# Altium project Tiny_Arduino.PrjPcb
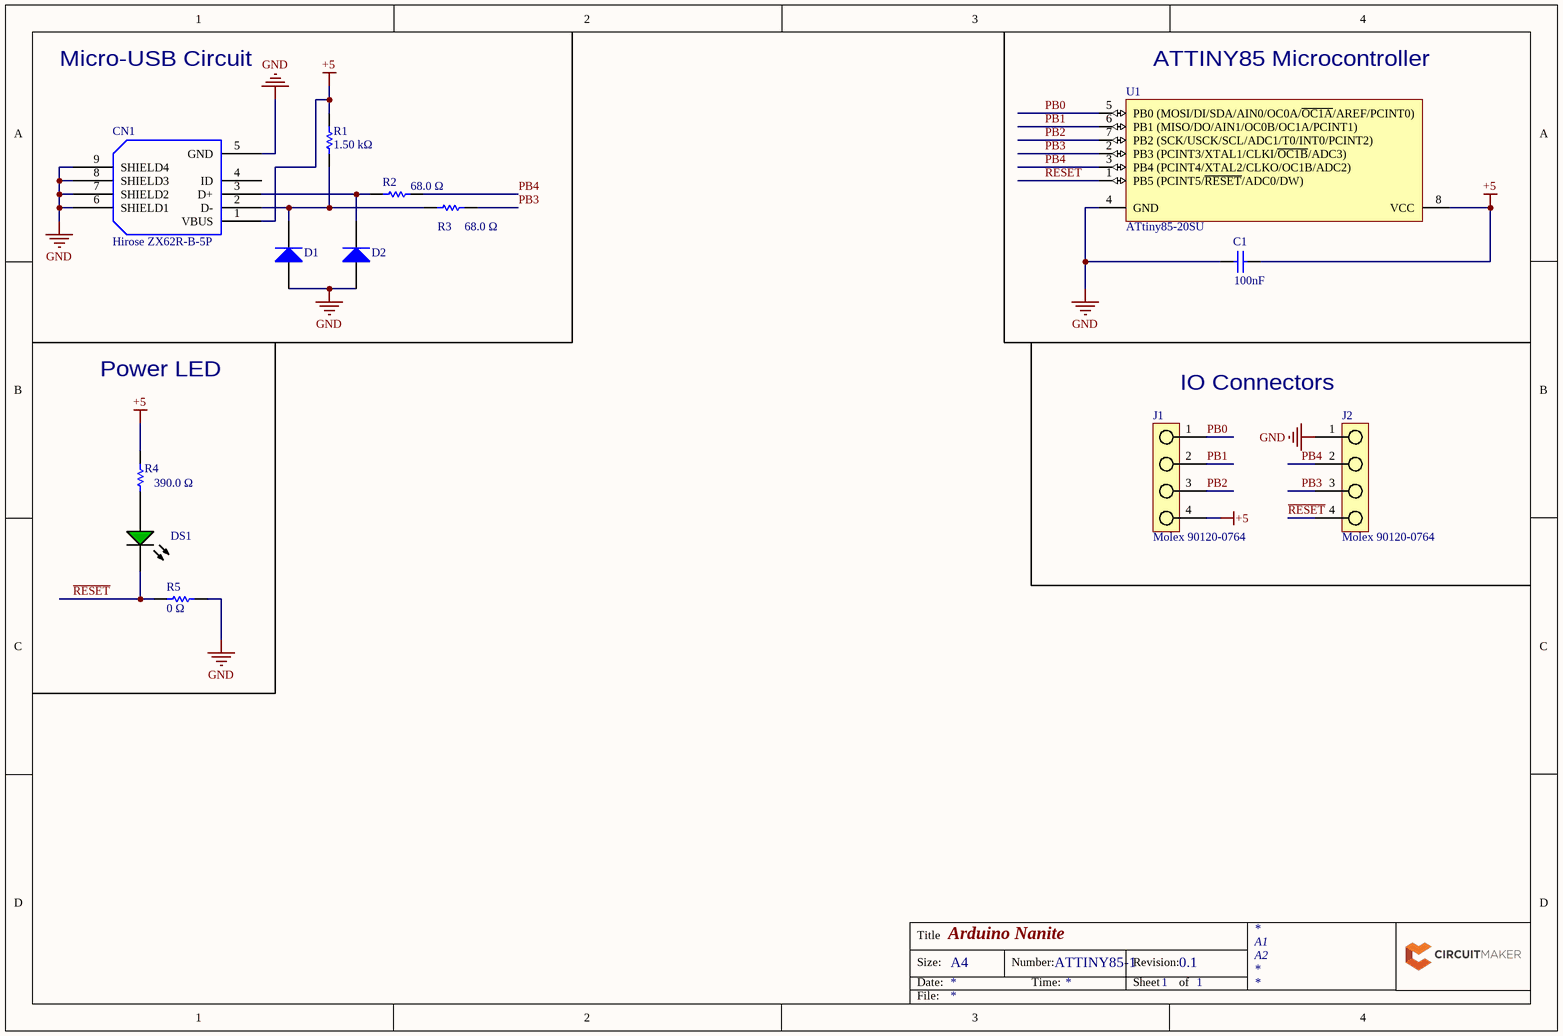
[diagram p0: Tiny_Arduino_Sch.SchDoc]
1 sheet, 13 parts. Net scope: global (net labels, ports and power ports of the same name join across sheets).

## Sheet Tiny_Arduino_Sch.SchDoc: Arduino Nanite
size A4; CompanyName: None; DrawnBy: Justin Beltran; Address1: A1; Address2: A2; DocumentNumber: ATTINY85-1; Revision: 0.1; SheetNumber: 1; SheetTotal: 1; ProjectName: Arduino_Nanite

### Parts
C1  Capacitance: 100nF  [CAPC1608X90X35LL15T15]  (hidden comment: AVX Interconnect / Elco 06033C104JAT2A)
CN1  Hirose ZX62R-B-5P  [PCB-kuo5gykd7jvbo0o0jro3-1]
D1  Panasonic DB2J40700L  [PCB-2omd1n8vppfni68elkoq-1]  (value not drawn)
D2  Panasonic DB2J40700L  [PCB-2omd1n8vppfni68elkoq-1]  (value not drawn)
DS1  Vishay Semiconductor TLMG1100-GS08  [VSH-TLMX1100]  (value not drawn)
J1  Molex 90120-0764  [PCB-mruwntkvy73mrw75dg9m-1]
J2  Molex 90120-0764  [PCB-mruwntkvy73mrw75dg9m-1]
R1  Resistance: 1.50 kΩ  [0603R]  (hidden comment: Panasonic / Panasonic ECG ERJ-3EKF1501V)
R2  Resistance: 68.0 Ω  [RESC1608X55X30LL15T15]  (hidden comment: Panasonic ERJ-3GEYJ680V)
R3  Resistance: 68.0 Ω  [RESC1608X55X30LL15T15]  (hidden comment: Panasonic ERJ-3GEYJ680V)
R4  Resistance: 390.0 Ω  [RESC1608X55X30LL15T15]  (hidden comment: Panasonic ERJ-3GEYJ391V)
R5  0 Ω  [RESC1608X05N]
U1  ATtiny85-20SU  [8S2_L]

### Nets
+5: C1.2 CN1.1(VBUS) J1.4 R1.2 R4.2 U1.8(VCC)
GND: C1.1 CN1.5(GND) CN1.6(SHIELD1) CN1.7(SHIELD2) CN1.8(SHIELD3) CN1.9(SHIELD4) D1.1(A) D2.1(A) J2.1 R5.2 U1.4(GND)
~{RESET}: DS1.2(K) J2.4 R5.1 U1.1(PB5_(PCINT5/~{RESET}/ADC0/DW))
PB0: J1.1 U1.5(PB0_(MOSI/DI/SDA/AIN0/OC0A/~{OC1A}/AREF/PCINT0))
PB1: J1.2 U1.6(PB1_(MISO/DO/AIN1/OC0B/OC1A/PCINT1))
PB2: J1.3 U1.7(PB2_(SCK/USCK/SCL/ADC1/T0/INT0/PCINT2))
PB3: J2.3 R3.2 U1.2(PB3_(PCINT3/XTAL1/CLKI/~{OC1B}/ADC3))
PB4: J2.2 R2.2 U1.3(PB4_(PCINT4/XTAL2/CLKO/OC1B/ADC2))
NetCN1_2: CN1.2(D-) D1.2(K) R1.1 R3.1
NetCN1_3: CN1.3(D+) D2.2(K) R2.1
NetDS1_1: DS1.1(A) R4.1

Not connected (* = marked no-connect by the designer): CN1 4(ID)

### Notes on the sheet
- Micro-USB Circuit
- (near U1) ATTINY85 Microcontroller
- Power LED
- IO Connectors
- Title
- Size:
- Date:
- A4
- Number:
- Time:
- Revision:
- Sheet
- of
- File:

### Library data of the parts
C1 = CMP-19299432-4: CAP CER 0.1UF 25V 5% X7R 0603; Voltage Rating (DC): 25.0 V; Dielectric Material: Ceramic Multilayer; Lead-Free Status: Lead Free; Mounting Style: Surface Mount; Case/Package: 0603; Dielectric Characteristic: X7R; Manufacturer Part Number: 06033C104JAT2A; Size-Height: 0.00086 m; RoHS: Compliant; Size-Length: 0.0016 m; Octopart Url: https://octopart.com/06033c104jat2a-avx+interconnect+%2F+elco-195750; Size-Width: 0.00081 m; REACH SVHC Compliance: No SVHC; Number of Pins: 2; Capacitance Tolerance: ±5%; OctopartID: 9a4d5345438d458a
CN1 = ZX62R-B-5P: copper, gold, series, pos, Connectors and Adapters, Wire to Board, pitch, solder, receptacle, conn, connector, rows, ...; Lead-Free Status: Lead Free; Gender: Female; Number of Contacts: 5; Mounting Style: Surface Mount; Orientation: Right Angle; Packaging: Cut Tape (CT); Octopart URL: http://octopart.com/zx62r-b-5p-hirose-44378731; Manufacturer Part Number: ZX62R-B-5P; RoHS: Compliant; OctopartID: d224198bdd290de3; REACH SVHC Compliance: No SVHC; Contact Plating: Gold; Contact Material: Copper
D1 D2 = CMP-6124aa8bc752bee3-1: Sc, Schottky Barrier Diode / Single, For Rectification, Vr: 40v, If: 500ma; Manufacturer Part Number: DB2J40700L; RoHS: Compliant; Octopart URL: http://octopart.com/db2j40700l-panasonic-44401424; OctopartID: 6124aa8bc752bee3; Number of Pins: 2; REACH SVHC Compliance: No SVHC; Lifecycle Status: Not Listed by Manufacturer
DS1 = CMP-1544807-2: LED 0603 ULTRA BRIGHT GRN 35MCD; Color: Green; Forward Voltage: 2.1 V; Lead-Free Status: Lead Free; Luminous Intensity: 0.035 cd; Peak Wavelength: 5.72e-07 m; Power Dissipation: 0.09 W; Viewing Angle: 160 °; Voltage Rating (DC): 3.0 V; Mounting Style: Surface Mount; Number of Pins: 2; Octopart Url: https://octopart.com/tlmg1100-gs08-vishay-42333640; OctopartID: 4d7f86f09dd192b8; REACH SVHC Compliance: No SVHC; RoHS: Compliant; Wavelength: 5.72e-07 m; Manufacturer Part Number: TLMG1100-GS08
J1 J2 = 90120-0764: 2.54mm (.100") Pitch C-Grid III Header, Single Row, Vertical, 3 Circuits, 0.38µm (15µ") Gold (Au) Selective Plating; Number of Contacts: 4; Current Rating: 3.00 A; Contact Resistance: 20.0 mΩ; Number of Circuits: 3; Gender: Male; Insulation Resistance: 5.00 GΩ; Lead-Free Status: Lead Free; Voltage Rating (DC): 350 V; Glow Wire Compliant: Non-Compliant; Contact Material: Copper; Mounting Style: Through Hole, Vertical; Octopart URL: http://octopart.com/90120-0764-molex-655426; RoHS: Compliant; Material: Polyester; Packaging: Bag; Manufacturer Part Number: 90120-0764; Voltage Rating (AC): 350 V; Size-Width: 2.54 mm; Pin Pitch: 2.54 mm; Housing Material: Plastic; Size-Height: 2.50 mm; Number of Positions: 4; Number of Rows: 1; Housing Color: Black; OctopartID: f5c93cc9d0ed2a0e; Lifecycle Status: Not Listed by Manufacturer; Orientation: Vertical; Halogen Free Status: Not Halogen Free; Size-Length: 10.2 mm; Contact Plating: Gold
R1 = CMP-3653708-3: Res Thick Film 0603 1.5K Ohm 1% 0.1W(1/10W) ??100ppm/??C Molded SMD Automotive T/R; Voltage Rating (DC): 75.0 V; Lead-Free Status: Lead Free; Power Rating: 100 mW; Lifecycle Status: Not Listed by Manufacturer; Size-Height: 450 µm; Octopart Url: http://octopart.com/erj-3ekf1501v-panasonic-55403651; Packaging: Tape & Reel (TR), Cut Tape (CT); OctopartID: a08c6acbe1697f4b; RoHS: Compliant; REACH SVHC Compliance: No SVHC; Manufacturer Part Number: ERJ-3EKF1501V; Resistance Tolerance: ±1%; Case/Package: 0603; Size-Length: 1.60 mm; Size-Width: 800 µm; Mounting Style: Surface Mount; Seller Landing  Url: https://octopart-clicks.com/click/track?country=US&ak=8157f166&sig=05cf646&sid=1106&ppid=55403651&vpid=188035540&ct=offers; Number of Pins: 2
R2 R3 = CMP-3708367-2: RES SMD 68 OHM 5% 1/10W 0603; Lead-Free Status: Lead Free; Power Rating: 0.1 W; Voltage Rating (DC): 75.0 V; Manufacturer Part Number: ERJ-3GEYJ680V; Case/Package: 0603; Lifecycle Status: Not Listed by Manufacturer; Mounting Style: Surface Mount; Octopart Url: https://octopart.com/erj-3geyj680v-panasonic-55422139; OctopartID: a4166e512dcb7bd1; Packaging: Cut Tape (CT); REACH SVHC Compliance: No SVHC; Resistance Tolerance: ±5%; RoHS: Compliant; Size-Height: 0.00045 m; Size-Length: 0.0016 m; Size-Width: 0.0008 m
R4 = CMP-3653665-2: Thick Film Resistors - SMD 0603 390ohms 5% Tol; Lead-Free Status: Lead Free; Power Rating: 0.1 W; Voltage Rating (DC): 75.0 V; Manufacturer Part Number: ERJ-3GEYJ391V; Case/Package: 0603; Lifecycle Status: Not Listed by Manufacturer; Mounting Style: Surface Mount; Octopart Url: https://octopart.com/erj-3geyj391v-panasonic-55422096; OctopartID: bc667621359063a1; Packaging: Cut Tape (CT); REACH SVHC Compliance: No SVHC; Resistance Tolerance: ±5%; RoHS: Compliant; Size-Height: 0.00045 m; Size-Length: 0.0016 m; Size-Width: 0.0008 m
R5 = CMP-31acf99032f6ee6b-1: RCA Series 0603 0.1 W 0 O Jumper Surface Mount Thick Film Chip Resistor; Manufacturer Part Number: RCA06030000ZSEA; Lead-Free Status: Lead Free; Power Rating: 100 mW; Case/Package (SI): 1608; RoHS: Compliant; Case/Package: 0603, 1608; OctopartID: 31acf99032f6ee6b; Packaging: Cut Tape (CT); Octopart URL: https://octopart.com/rca06030000zsea-vishay-20325948
U1 = ATTINY85-20SU: 8-bit AVR Microcontroller, 20MHz, 2.7-5.5V, 8K Flash, 512 Bytes EEPROM, 512 Bytes SRAM, Industrial Grade (-40°C to 85°C), 8-Lead SOIC, Pb-Free; Supply Voltage (DC): 5.0 V; FLASH Memory Size: 8192 B; RAM Memory Size: 512 B; Clock Speed: 20000000.0 Hz; Number of I/O Pins: 6; Lead-Free Status: Lead Free; Access Time: 2e-05 s; RoHS: Compliant; OctopartID: 4ed985889323911e; Mounting Style: Surface Mount; Octopart Url: https://octopart.com/attiny85-20su-atmel-39581852; Number of Pins: 8; Packaging: Tube; Core Architecture: AVR; Manufacturer Part Number: ATTINY85-20SU; REACH SVHC Compliance: No SVHC; Case/Package: SOIC